# EAGLE schematic fuzz-bass (EAGLE 9.6.1)
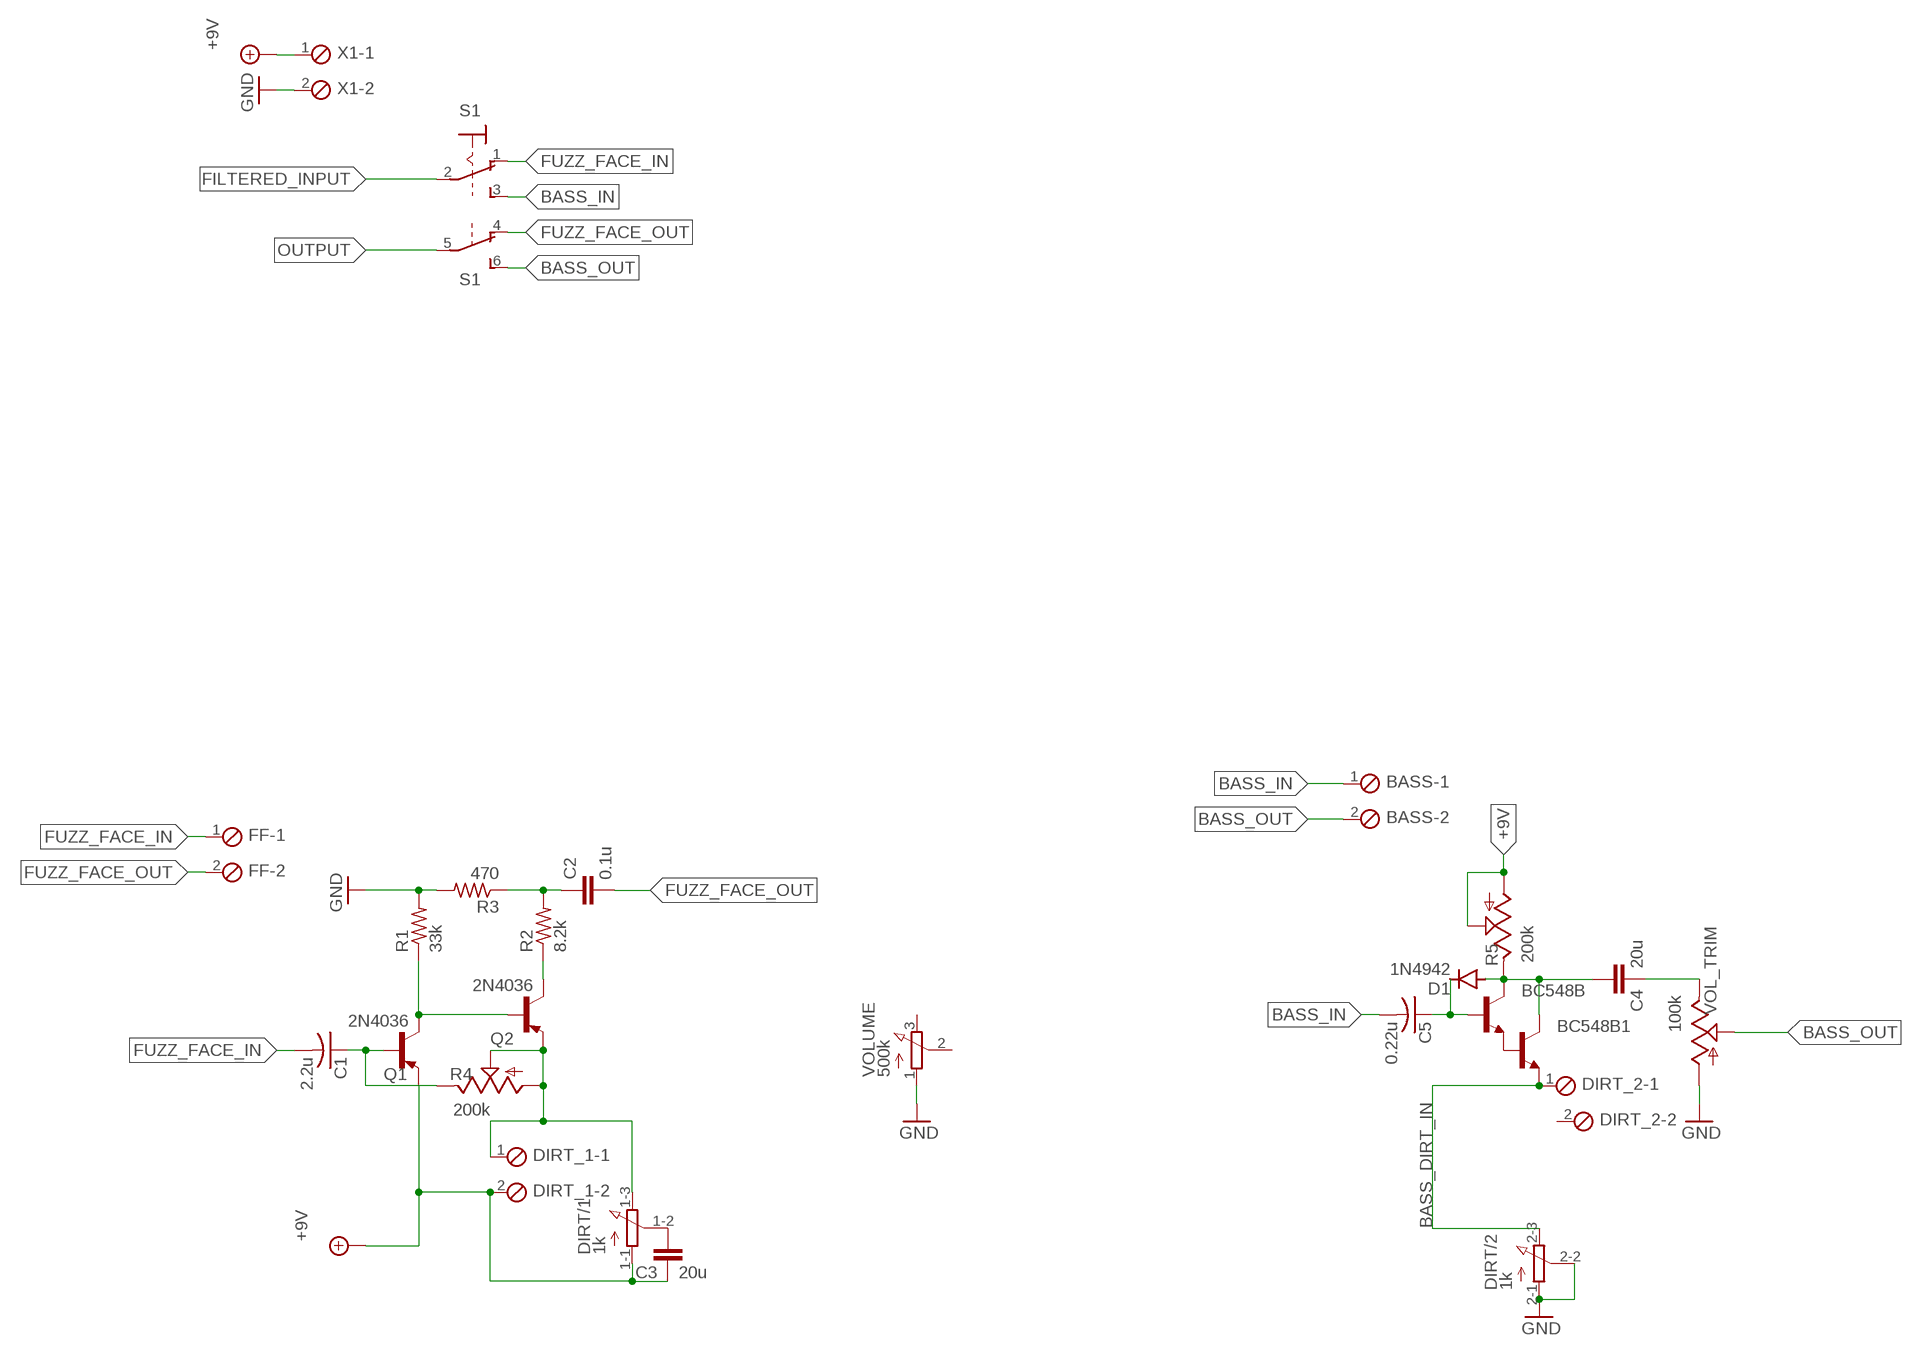
[diagram p0: schematic, sheet 1]

## Parts
BASS  MPT2  [2POL254]
BC548B  -NPN-TO92L  [TO92L]
BC548B1  -NPN-TO92L  [TO92L]
C1  2.2u  C-US025-050X050  [C025-050X050]
C2  0.1u  C-EU050-024X044  [C050-024X044]
C3  20u  C-EU025-030X050  [C025-030X050]
C4  20u  C-EU025-030X050  [C025-030X050]
C5  0.22u  C-US025-050X050  [C025-050X050]
D1  1N4942  [DO41-10]
DIRT  1k  3RP/1610G  [3RP/1610G]
DIRT_1  MPT2  [2POL254]
DIRT_2  MPT2  [2POL254]
FF  MPT2  [2POL254]
Q1  2N4036  [TO5]
Q2  2N4036  [TO5]
R1  33k  R-US_0204/7  [0204/7]
R2  8.2k  R-US_0204/7  [0204/7]
R3  470  R-US_0204/7  [0204/7]
R4  200k  TRIM_US-RJ9W  [RJ9W]
R5  200k  TRIM_US-RJ9W  [RJ9W]
S1  M9040P2  [M9040P2]
VOL_TRIM  100k  TRIM_US-RJ9W  [RJ9W]
VOLUME  500k  3RP/1610N  [3RP/1610N]
X1  MPT2  [2POL254]

## Nets
+9V: C3.1 DIRT.1-1(/1:A) DIRT_1.2 Q1.1(E) R5.A R5.S X1.1
BASS_DIRT_IN: BC548B1.1(E) DIRT.2-3(/2:E) DIRT_2.1
BASS_IN: BASS.1 C5.2 S1.3(1:S)
BASS_OUT: BASS.2 S1.6(2:S) VOL_TRIM.S
FILTERED_INPUT: S1.2(1:P)
FUZZ_FACE_IN: C1.2 FF.1 S1.1(1:O)
FUZZ_FACE_OUT: C2.2 FF.2 S1.4(2:O)
GND: DIRT.2-1(/2:A) DIRT.2-2(/2:S) R1.2 R3.2 VOL_TRIM.A VOLUME.1(A) X1.2
N$1: Q2.3(C) R2.1
N$2: DIRT.1-3(/1:E) DIRT_1.1 Q2.1(E) R4.A R4.S
N$3: C1.1 Q1.2(B) R4.E
N$4: Q1.3(C) Q2.2(B) R1.1
N$5: C3.2 DIRT.1-2(/1:S)
N$6: C2.1 R2.2 R3.1
N$7: BC548B1.2(B) BC548B.1(E)
N$8: BC548B1.3(C) BC548B.3(C) C4.2 D1.A R5.E
N$11: BC548B.2(B) C5.1 D1.C
N$12: C4.1 VOL_TRIM.E
OUTPUT: S1.5(2:P)
Unconnected: DIRT_2.2 VOLUME.2(S) VOLUME.3(E)

## Library data of the parts
BASS DIRT_1 DIRT_2 FF X1 = con-phoenix-254:MPT2: PHOENIX CONNECTOR; OC_FARNELL: unknown; OC_NEWARK: unknown
BC548B BC548B1 = transistor:*-NPN-: NPN Transistror BF959 corrected 2008.03.06
C1 C5 = adafruit:C-US: CAPACITOR, American symbol
C2-C4 = rcl:C-EU: CAPACITOR, European symbol; SPICEPREFIX: C
D1 = diode:1N4942: DIODE 1.0 A, 200 V, 150 ns
DIRT = pot:3RP/1610G: 16mm Potentiometer two level Source: http://www.alphapotentiometers.net/html/16mm_pot_2.html
Q1 Q2 = transistor-pnp:2N4036: PNP Transistor
R1-R3 = rcl:R-US_: RESISTOR, American symbol; SPICEPREFIX: R
R4 R5 VOL_TRIM = pot:TRIM_US-: POTENTIOMETER
S1 = switch:M9040P2: TOGGLE SWITCH Marquardt
VOLUME = pot:3RP/1610N: 16mm Potentiometer one level Source: http://www.alphapotentiometers.net/html/16mm_pot_2.html

## Module FUZZ_FACE
Ports: 

### Library data of the parts